# Altium project Ultrasound Smart Probe_Ver2.PrjPcb (part 2 of 9)

## Sheet FX3_Interface.SchDoc: FX3 Interface
size 431 x 279 mm; Date: Not shown in title block; ApprovedBy: Not shown in title block; CheckedBy: Not shown in title block; Author: Not shown in title block; CompanyName: Not shown in title block; DrawnBy: Abhishek Vishwa; Engineer: Not shown in title block; Organization: Not shown in title block; Address1: Not shown in title block; Address2: Not shown in title block; Address3: Not shown in title block; Address4: Not shown in title block; DocumentNumber: 1; Revision: Use project parameter SCH_Rev; SheetNumber: 3; SheetTotal: 12; PageSetup: Record=PageOptions|CenterHorizontal=True|CenterVertical=True|PrintScale=1.00|XCorrection=1.00|YCorrection=1.00|PrintKind=0|BorderSize=5000000|LeftOffset=0|BottomOffset=0|Orientation=2|PaperLength=1000|PaperWidth=1000|Scale=100|PaperSource=15|PrintQuality=600|MediaType=1|DitherType=10|PaperKind=Letter|PrintScaleMode=1; CurrentTime: Not shown in title block; CurrentDate: Not shown in title block; Time: Not shown in title block; DocumentFullPathAndName: Not shown in title block; DocumentName: Not shown in title block; ModifiedDate: Not shown in title block; ImagePath: Not shown in title block
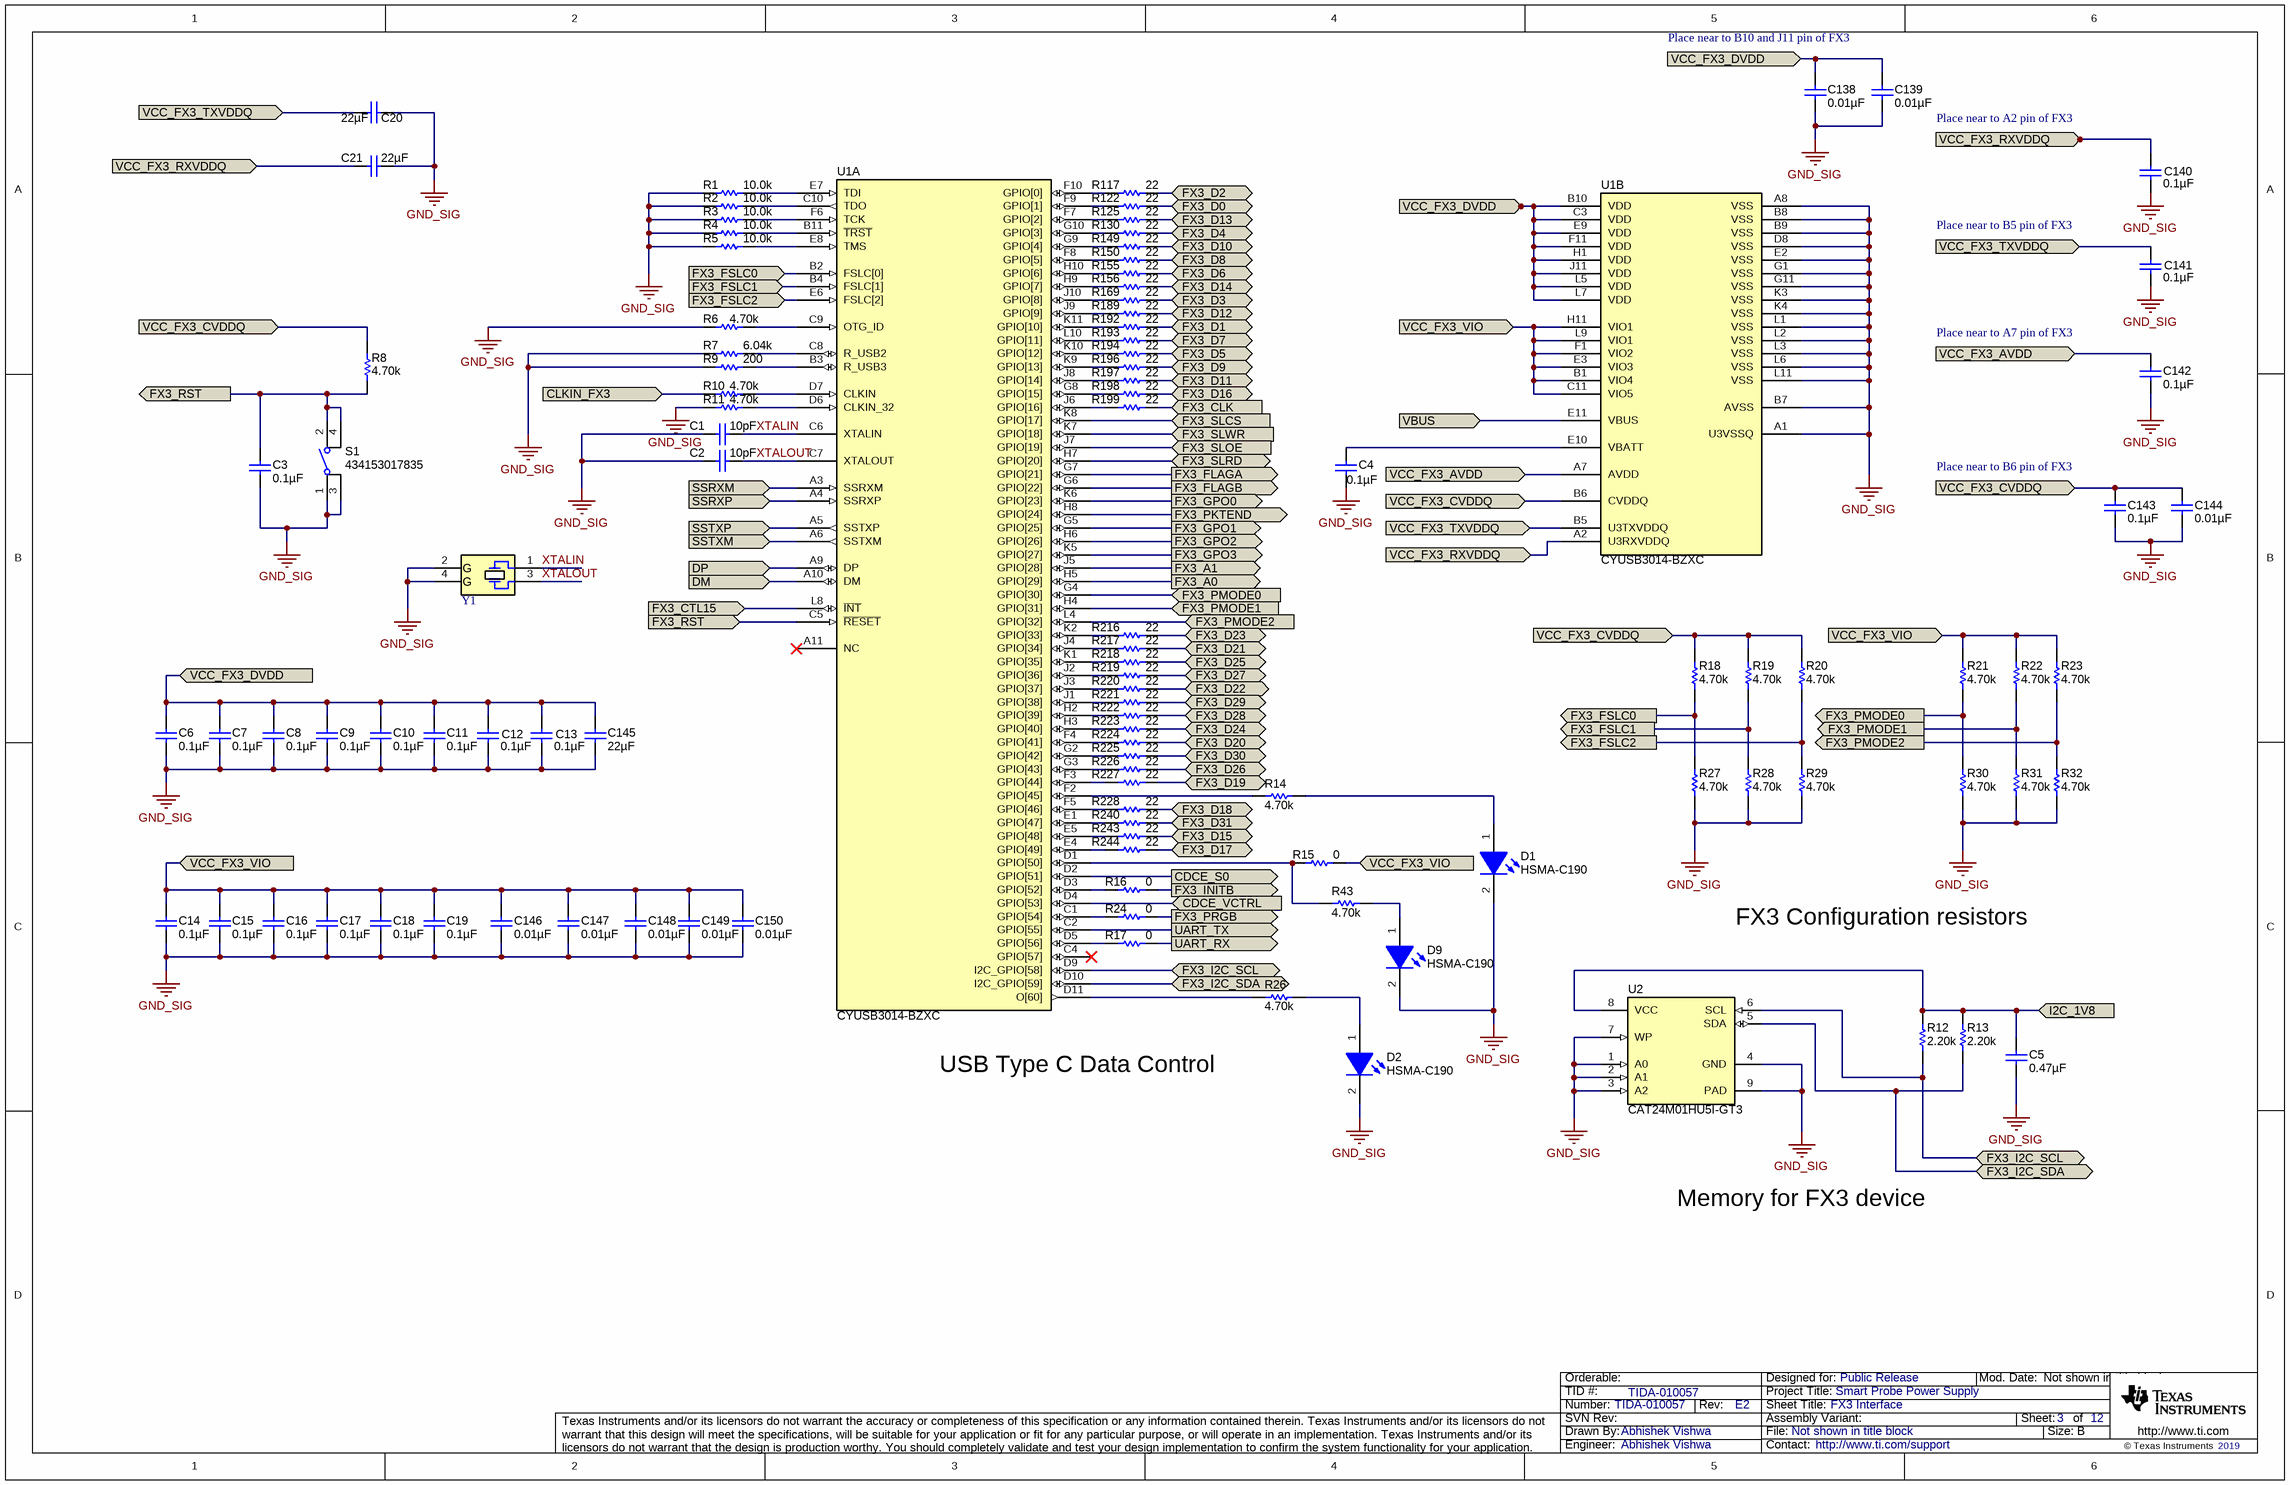
[diagram p1: FX3_Interface.SchDoc]

### Parts
C1  ValueDisplayed: 10pF  [0402]  (hidden comment: GRM1555C1H100FA01D)
C2  ValueDisplayed: 10pF  [0402]  (hidden comment: GRM1555C1H100FA01D)
C3  ValueDisplayed: 0.1µF  [0402]  (hidden comment: GRM155R61E104KA87D)
C4  ValueDisplayed: 0.1µF  [0402]  (hidden comment: GRM155R61E104KA87D)
C5  ValueDisplayed: 0.47µF  [0603]  (hidden comment: GRM188R61C474KA93D)
C6  ValueDisplayed: 0.1µF  [0201_033]  (hidden comment: C0603X6S1C104K030BC)
C7  ValueDisplayed: 0.1µF  [0201_033]  (hidden comment: C0603X6S1C104K030BC)
C8  ValueDisplayed: 0.1µF  [0201_033]  (hidden comment: C0603X6S1C104K030BC)
C9  ValueDisplayed: 0.1µF  [0201_033]  (hidden comment: C0603X6S1C104K030BC)
C10  ValueDisplayed: 0.1µF  [0201_033]  (hidden comment: C0603X6S1C104K030BC)
C11  ValueDisplayed: 0.1µF  [0201_033]  (hidden comment: C0603X6S1C104K030BC)
C12  ValueDisplayed: 0.1µF  [0201_033]  (hidden comment: C0603X6S1C104K030BC)
C13  ValueDisplayed: 0.1µF  [0201_033]  (hidden comment: C0603X6S1C104K030BC)
C14  ValueDisplayed: 0.1µF  [0201_033]  (hidden comment: C0603X6S1C104K030BC)
C15  ValueDisplayed: 0.1µF  [0201_033]  (hidden comment: C0603X6S1C104K030BC)
C16  ValueDisplayed: 0.1µF  [0201_033]  (hidden comment: C0603X6S1C104K030BC)
C17  ValueDisplayed: 0.1µF  [0201_033]  (hidden comment: C0603X6S1C104K030BC)
C18  ValueDisplayed: 0.1µF  [0201_033]  (hidden comment: C0603X6S1C104K030BC)
C19  ValueDisplayed: 0.1µF  [0201_033]  (hidden comment: C0603X6S1C104K030BC)
C20  ValueDisplayed: 22µF  [0603]  (hidden comment: C1608X5R0J226M080AC)
C21  ValueDisplayed: 22µF  [0603]  (hidden comment: C1608X5R0J226M080AC)
C138  ValueDisplayed: 0.01µF  [0201]  (hidden comment: GRM033R60J103KA01D)
C139  ValueDisplayed: 0.01µF  [0201]  (hidden comment: GRM033R60J103KA01D)
C140  ValueDisplayed: 0.1µF  [0201_033]  (hidden comment: C0603X6S1C104K030BC)
C141  ValueDisplayed: 0.1µF  [0201_033]  (hidden comment: C0603X6S1C104K030BC)
C142  ValueDisplayed: 0.1µF  [0201_033]  (hidden comment: C0603X6S1C104K030BC)
C143  ValueDisplayed: 0.1µF  [0201_033]  (hidden comment: C0603X6S1C104K030BC)
C144  ValueDisplayed: 0.01µF  [0201]  (hidden comment: GRM033R60J103KA01D)
C145  ValueDisplayed: 22µF  [0603]  (hidden comment: C1608X5R0J226M080AC)
C146  ValueDisplayed: 0.01µF  [0201]  (hidden comment: GRM033R60J103KA01D)
C147  ValueDisplayed: 0.01µF  [0201]  (hidden comment: GRM033R60J103KA01D)
C148  ValueDisplayed: 0.01µF  [0201]  (hidden comment: GRM033R60J103KA01D)
C149  ValueDisplayed: 0.01µF  [0201]  (hidden comment: GRM033R60J103KA01D)
C150  ValueDisplayed: 0.01µF  [0201]  (hidden comment: GRM033R60J103KA01D)
D1  HSMA-C190  [HSMx-C190_Amber]
D2  HSMA-C190  [HSMx-C190_Amber]
D9  HSMA-C190  [HSMx-C190_Amber]
R1  ValueDisplayed: 10.0k  [0402]  (hidden comment: ERJ-2RKF1002X)
R2  ValueDisplayed: 10.0k  [0402]  (hidden comment: ERJ-2RKF1002X)
R3  ValueDisplayed: 10.0k  [0402]  (hidden comment: ERJ-2RKF1002X)
R4  ValueDisplayed: 10.0k  [0402]  (hidden comment: ERJ-2RKF1002X)
R5  ValueDisplayed: 10.0k  [0402]  (hidden comment: ERJ-2RKF1002X)
R6  ValueDisplayed: 4.70k  [0402]  (hidden comment: ERJ-2RKF4701X)
R7  ValueDisplayed: 6.04k  [0402]  (hidden comment: CRCW04026K04FKED)
R8  ValueDisplayed: 4.70k  [0402]  (hidden comment: ERJ-2RKF4701X)
R9  ValueDisplayed: 200  [0603]  (hidden comment: CRCW0603200RFKEA)
R10  ValueDisplayed: 4.70k  [0402]  (hidden comment: ERJ-2RKF4701X)
R11  ValueDisplayed: 4.70k  [0402]  (hidden comment: ERJ-2RKF4701X)
R12  ValueDisplayed: 2.20k  [0402]  (hidden comment: ERJ-2RKF2201X)
R13  ValueDisplayed: 2.20k  [0402]  (hidden comment: ERJ-2RKF2201X)
R14  ValueDisplayed: 4.70k  [0402]  (hidden comment: ERJ-2RKF4701X)
R15  ValueDisplayed: 0  [0402]  (hidden comment: ERJ-2GE0R00X)
R16  ValueDisplayed: 0  [0402]  (hidden comment: ERJ-2GE0R00X)
R17  ValueDisplayed: 0  [0402]  (hidden comment: ERJ-2GE0R00X)
R18  ValueDisplayed: 4.70k  [0201]  (hidden comment: RC0201DR-074K7L)
R19  ValueDisplayed: 4.70k  [0201]  (hidden comment: RC0201DR-074K7L)
R20  ValueDisplayed: 4.70k  [0201]  (hidden comment: RC0201DR-074K7L)
R21  ValueDisplayed: 4.70k  [0201]  (hidden comment: RC0201DR-074K7L)
R22  ValueDisplayed: 4.70k  [0201]  (hidden comment: RC0201DR-074K7L)
R23  ValueDisplayed: 4.70k  [0201]  (hidden comment: RC0201DR-074K7L)
R24  ValueDisplayed: 0  [0402]  (hidden comment: ERJ-2GE0R00X)
R26  ValueDisplayed: 4.70k  [0402]  (hidden comment: ERJ-2RKF4701X)
R27  ValueDisplayed: 4.70k  [0201]  (hidden comment: RC0201DR-074K7L)
R28  ValueDisplayed: 4.70k  [0201]  (hidden comment: RC0201DR-074K7L)
R29  ValueDisplayed: 4.70k  [0201]  (hidden comment: RC0201DR-074K7L)
R30  ValueDisplayed: 4.70k  [0201]  (hidden comment: RC0201DR-074K7L)
R31  ValueDisplayed: 4.70k  [0201]  (hidden comment: RC0201DR-074K7L)
R32  ValueDisplayed: 4.70k  [0201]  (hidden comment: RC0201DR-074K7L)
R43  ValueDisplayed: 4.70k  [0402]  (hidden comment: ERJ-2RKF4701X)
R117  ValueDisplayed: 22  [0201]  (hidden comment: RC0201JR-0722RL)
R122  ValueDisplayed: 22  [0201]  (hidden comment: RC0201JR-0722RL)
R125  ValueDisplayed: 22  [0201]  (hidden comment: RC0201JR-0722RL)
R130  ValueDisplayed: 22  [0201]  (hidden comment: RC0201JR-0722RL)
R149  ValueDisplayed: 22  [0201]  (hidden comment: RC0201JR-0722RL)
R150  ValueDisplayed: 22  [0201]  (hidden comment: RC0201JR-0722RL)
R155  ValueDisplayed: 22  [0201]  (hidden comment: RC0201JR-0722RL)
R156  ValueDisplayed: 22  [0201]  (hidden comment: RC0201JR-0722RL)
R169  ValueDisplayed: 22  [0201]  (hidden comment: RC0201JR-0722RL)
R189  ValueDisplayed: 22  [0201]  (hidden comment: RC0201JR-0722RL)
R192  ValueDisplayed: 22  [0201]  (hidden comment: RC0201JR-0722RL)
R193  ValueDisplayed: 22  [0201]  (hidden comment: RC0201JR-0722RL)
R194  ValueDisplayed: 22  [0201]  (hidden comment: RC0201JR-0722RL)
R196  ValueDisplayed: 22  [0201]  (hidden comment: RC0201JR-0722RL)
R197  ValueDisplayed: 22  [0201]  (hidden comment: RC0201JR-0722RL)
R198  ValueDisplayed: 22  [0201]  (hidden comment: RC0201JR-0722RL)
R199  ValueDisplayed: 22  [0201]  (hidden comment: RC0201JR-0722RL)
R216  ValueDisplayed: 22  [0201]  (hidden comment: RC0201JR-0722RL)
R217  ValueDisplayed: 22  [0201]  (hidden comment: RC0201JR-0722RL)
R218  ValueDisplayed: 22  [0201]  (hidden comment: RC0201JR-0722RL)
R219  ValueDisplayed: 22  [0201]  (hidden comment: RC0201JR-0722RL)
R220  ValueDisplayed: 22  [0201]  (hidden comment: RC0201JR-0722RL)
R221  ValueDisplayed: 22  [0201]  (hidden comment: RC0201JR-0722RL)
R222  ValueDisplayed: 22  [0201]  (hidden comment: RC0201JR-0722RL)
R223  ValueDisplayed: 22  [0201]  (hidden comment: RC0201JR-0722RL)
R224  ValueDisplayed: 22  [0201]  (hidden comment: RC0201JR-0722RL)
R225  ValueDisplayed: 22  [0201]  (hidden comment: RC0201JR-0722RL)
R226  ValueDisplayed: 22  [0201]  (hidden comment: RC0201JR-0722RL)
R227  ValueDisplayed: 22  [0201]  (hidden comment: RC0201JR-0722RL)
R228  ValueDisplayed: 22  [0201]  (hidden comment: RC0201JR-0722RL)
R240  ValueDisplayed: 22  [0201]  (hidden comment: RC0201JR-0722RL)
R243  ValueDisplayed: 22  [0201]  (hidden comment: RC0201JR-0722RL)
R244  ValueDisplayed: 22  [0201]  (hidden comment: RC0201JR-0722RL)
S1  434153017835  [SW_434153017835]
U1  CYUSB3014-BZXC  [BZ-121]  (parts A,B of 2)
U2  CAT24M01HU5I-GT3  [8MA2]
Y1  ECS-192-18-33-JEM-TR  [ECS_ECX-32]  (value not drawn)

### Ports
CDCE_S0 (out), CDCE_VCTRL (in), CLKIN_FX3 (in), DM (in), DP (in), FX3_A0 (out), FX3_A1 (out), FX3_CLK (in), FX3_CTL15 (in), FX3_D0 (bidir), FX3_D1 (bidir), FX3_D2 (bidir), FX3_D3 (bidir), FX3_D4 (bidir), FX3_D5 (bidir), FX3_D6 (bidir), FX3_D7 (bidir), FX3_D8 (bidir), FX3_D9 (bidir), FX3_D10 (bidir), FX3_D11 (bidir), FX3_D12 (bidir), FX3_D13 (bidir), FX3_D14 (bidir), FX3_D15 (bidir), FX3_D16 (bidir), FX3_D17 (bidir), FX3_D18 (bidir), FX3_D19 (bidir), FX3_D20 (bidir), FX3_D21 (bidir), FX3_D22 (bidir), FX3_D23 (bidir), FX3_D24 (bidir), FX3_D25 (bidir), FX3_D26 (bidir), FX3_D27 (bidir), FX3_D28 (bidir), FX3_D29 (bidir), FX3_D30 (bidir), FX3_D31 (bidir), FX3_FLAGA (out), FX3_FLAGB (out), FX3_FSLC0 (in), FX3_FSLC0 (out), FX3_FSLC1 (in), FX3_FSLC1 (out), FX3_FSLC2 (in), FX3_FSLC2 (out), FX3_GPO0 (out), FX3_GPO1 (out), FX3_GPO2 (out), FX3_GPO3 (out), FX3_I2C_SCL (bidir), FX3_I2C_SDA (bidir), FX3_INITB (out), FX3_PKTEND (out), FX3_PMODE0 (in), FX3_PMODE0 (out), FX3_PMODE1 (in), FX3_PMODE1 (out), FX3_PMODE2 (in), FX3_PMODE2 (out), FX3_PRGB (out), FX3_RST (in), FX3_RST (out), FX3_SLCS (in), FX3_SLOE (in), FX3_SLRD (bidir), FX3_SLWR (in), I2C_1V8 (in), SSRXM (in), SSRXP (in), SSTXM (in), SSTXP (in), UART_RX (out), UART_TX (out), VBUS (in), VCC_FX3_AVDD (in), VCC_FX3_CVDDQ (in), VCC_FX3_DVDD (in), VCC_FX3_RXVDDQ (in), VCC_FX3_TXVDDQ (in), VCC_FX3_VIO (in)

### Nets
GND_SIG: C1.2 C2.2 C3.2 C4.2 C5.2 C6.2 C7.2 C8.2 C9.2 C10.2 C11.2 C12.2 C13.2 C14.2 C15.2 C16.2 C17.2 C18.2 C19.2 C20.1 C21.1 C138.2 C139.1 C140.2 C141.2 C142.2 C143.2 C144.2 C145.2 C146.2 C147.2 C148.2 C149.2 C150.2 D1.2(K) D2.2(K) D9.2(K) R1.1 R2.1 R3.1 R4.1 R5.1 R6.1 R7.2 R9.1 R11.1 R27.1 R28.1 R29.1 R30.1 R31.1 R32.1 S1.1 S1.3 U1.A1(U3VSSQ) U1.A8(VSS) U1.B7(AVSS) U1.B8(VSS) U1.B9(VSS) U1.D8(VSS) U1.E2(VSS) U1.G1(VSS) U1.G11(VSS) U1.K3(VSS) U1.K4(VSS) U1.L1(VSS) U1.L2(VSS) U1.L3(VSS) U1.L6(VSS) U1.L11(VSS) U2.1(A0) U2.2(A1) U2.3(A2) U2.4(GND) U2.7(WP) U2.9(PAD) Y1.2(GND) Y1.4(GND)
CDCE_S0: U1.D2(GPIO[51]) ; port CDCE_S0
CDCE_VCTRL: U1.D4(GPIO[53]) ; port CDCE_VCTRL
CLKIN_FX3: R10.1 ; port CLKIN_FX3
DM: U1.A10(DM) ; port DM
DP: U1.A9(DP) ; port DP
FX3_A0: U1.H5(GPIO[29]) ; port FX3_A0
FX3_A1: U1.J5(GPIO[28]) ; port FX3_A1
FX3_CLK: R199.2 ; port FX3_CLK
FX3_CTL15: U1.L8(~{INT}) ; port FX3_CTL15
FX3_D0: R122.2 ; port FX3_D0
FX3_D1: R192.2 ; port FX3_D1
FX3_D2: R117.2 ; port FX3_D2
FX3_D3: R169.2 ; port FX3_D3
FX3_D4: R130.2 ; port FX3_D4
FX3_D5: R194.2 ; port FX3_D5
FX3_D6: R155.2 ; port FX3_D6
FX3_D7: R193.2 ; port FX3_D7
FX3_D8: R150.2 ; port FX3_D8
FX3_D9: R196.2 ; port FX3_D9
FX3_D10: R149.2 ; port FX3_D10
FX3_D11: R197.2 ; port FX3_D11
FX3_D12: R189.2 ; port FX3_D12
FX3_D13: R125.2 ; port FX3_D13
FX3_D14: R156.2 ; port FX3_D14
FX3_D15: R243.2 ; port FX3_D15
FX3_D16: R198.2 ; port FX3_D16
FX3_D17: R244.2 ; port FX3_D17
FX3_D18: R228.2 ; port FX3_D18
FX3_D19: R227.2 ; port FX3_D19
FX3_D20: R224.2 ; port FX3_D20
FX3_D21: R217.2 ; port FX3_D21
FX3_D22: R220.2 ; port FX3_D22
FX3_D23: R216.2 ; port FX3_D23
FX3_D24: R223.2 ; port FX3_D24
FX3_D25: R218.2 ; port FX3_D25
FX3_D26: R226.2 ; port FX3_D26
FX3_D27: R219.2 ; port FX3_D27
FX3_D28: R222.2 ; port FX3_D28
FX3_D29: R221.2 ; port FX3_D29
FX3_D30: R225.2 ; port FX3_D30
FX3_D31: R240.2 ; port FX3_D31
FX3_FLAGA: U1.G7(GPIO[21]) ; port FX3_FLAGA
FX3_FLAGB: U1.G6(GPIO[22]) ; port FX3_FLAGB
FX3_FSLC0: R18.1 R27.2 U1.B2(FSLC[0]) ; port FX3_FSLC0
FX3_FSLC1: R19.1 R28.2 U1.B4(FSLC[1]) ; port FX3_FSLC1
FX3_FSLC2: R20.1 R29.2 U1.E6(FSLC[2]) ; port FX3_FSLC2
FX3_GPO0: U1.K6(GPIO[23]) ; port FX3_GPO0
FX3_GPO1: U1.G5(GPIO[25]) ; port FX3_GPO1
FX3_GPO2: U1.H6(GPIO[26]) ; port FX3_GPO2
FX3_GPO3: U1.K5(GPIO[27]) ; port FX3_GPO3
FX3_I2C_SCL: R12.1 U1.D9(I2C_GPIO[58]) U2.6(SCL) ; port FX3_I2C_SCL
FX3_I2C_SDA: R13.1 U1.D10(I2C_GPIO[59]) U2.5(SDA) ; port FX3_I2C_SDA
FX3_INITB: R16.2 ; port FX3_INITB
FX3_PKTEND: U1.H8(GPIO[24]) ; port FX3_PKTEND
FX3_PMODE0: R21.1 R30.2 U1.G4(GPIO[30]) ; port FX3_PMODE0
FX3_PMODE1: R22.1 R31.2 U1.H4(GPIO[31]) ; port FX3_PMODE1
FX3_PMODE2: R23.1 R32.2 U1.L4(GPIO[32]) ; port FX3_PMODE2
FX3_PRGB: R24.2 ; port FX3_PRGB
FX3_RST: C3.1 R8.1 S1.2 S1.4 U1.C5(~{RESET}) ; port FX3_RST
FX3_SLCS: U1.K8(GPIO[17]) ; port FX3_SLCS
FX3_SLOE: U1.J7(GPIO[19]) ; port FX3_SLOE
FX3_SLRD: U1.H7(GPIO[20]) ; port FX3_SLRD
FX3_SLWR: U1.K7(GPIO[18]) ; port FX3_SLWR
I2C_1V8: C5.1 R12.2 R13.2 U2.8(VCC) ; port I2C_1V8
SSRXM: U1.A3(SSRXM) ; port SSRXM
SSRXP: U1.A4(SSRXP) ; port SSRXP
SSTXM: U1.A6(SSTXM) ; port SSTXM
SSTXP: U1.A5(SSTXP) ; port SSTXP
UART_RX: R17.2 ; port UART_RX
UART_TX: U1.C2(GPIO[55]) ; port UART_TX
VBUS: U1.E11(VBUS) ; port VBUS
VCC_FX3_AVDD: C142.1 U1.A7(AVDD) ; port VCC_FX3_AVDD
VCC_FX3_CVDDQ: C143.1 C144.1 R8.2 R18.2 R19.2 R20.2 U1.B6(CVDDQ) ; port VCC_FX3_CVDDQ
VCC_FX3_DVDD: C6.1 C7.1 C8.1 C9.1 C10.1 C11.1 C12.1 C13.1 C138.1 C139.2 C145.1 U1.B10(VDD) U1.C3(VDD) U1.E9(VDD) U1.F11(VDD) U1.H1(VDD) U1.J11(VDD) U1.L5(VDD) U1.L7(VDD) ; port VCC_FX3_DVDD
VCC_FX3_RXVDDQ: C21.2 C140.1 U1.A2(U3RXVDDQ) ; port VCC_FX3_RXVDDQ
VCC_FX3_TXVDDQ: C20.2 C141.1 U1.B5(U3TXVDDQ) ; port VCC_FX3_TXVDDQ
VCC_FX3_VIO: C14.1 C15.1 C16.1 C17.1 C18.1 C19.1 C146.1 C147.1 C148.1 C149.1 C150.1 R15.2 R21.2 R22.2 R23.2 U1.B1(VIO4) U1.C11(VIO5) U1.E3(VIO3) U1.F1(VIO2) U1.H11(VIO1) U1.L9(VIO1) ; port VCC_FX3_VIO
XTALIN: C1.1 U1.C6(XTALIN) Y1.1
XTALOUT: C2.1 U1.C7(XTALOUT) Y1.3
NetC4_1: C4.1 U1.E10(VBATT)
NetD1_1: D1.1(A) R14.2
NetD2_1: D2.1(A) R26.2
NetD9_1: D9.1(A) R43.2
NetR1_2: R1.2 U1.E7(TDI)
NetR2_2: R2.2 U1.C10(TDO)
NetR3_2: R3.2 U1.F6(TCK)
NetR4_2: R4.2 U1.B11(~{TRST})
NetR5_2: R5.2 U1.E8(TMS)
NetR6_2: R6.2 U1.C9(OTG_ID)
NetR7_1: R7.1 U1.C8(R_USB2)
NetR9_2: R9.2 U1.B3(R_USB3)
NetR10_2: R10.2 U1.D7(CLKIN)
NetR11_2: R11.2 U1.D6(CLKIN_32)
NetR14_1: R14.1 U1.F2(GPIO[45])
NetR15_1: R15.1 R43.1 U1.D1(GPIO[50])
NetR16_1: R16.1 U1.D3(GPIO[52])
NetR17_1: R17.1 U1.D5(GPIO[56])
NetR24_1: R24.1 U1.C1(GPIO[54])
NetR26_1: R26.1 U1.D11(O[60])
NetR117_1: R117.1 U1.F10(GPIO[0])
NetR122_1: R122.1 U1.F9(GPIO[1])
NetR125_1: R125.1 U1.F7(GPIO[2])
NetR130_1: R130.1 U1.G10(GPIO[3])
NetR149_1: R149.1 U1.G9(GPIO[4])
NetR150_1: R150.1 U1.F8(GPIO[5])
NetR155_1: R155.1 U1.H10(GPIO[6])
NetR156_1: R156.1 U1.H9(GPIO[7])
NetR169_1: R169.1 U1.J10(GPIO[8])
NetR189_1: R189.1 U1.J9(GPIO[9])
NetR192_1: R192.1 U1.K11(GPIO[10])
NetR193_1: R193.1 U1.L10(GPIO[11])
NetR194_1: R194.1 U1.K10(GPIO[12])
NetR196_1: R196.1 U1.K9(GPIO[13])
NetR197_1: R197.1 U1.J8(GPIO[14])
NetR198_1: R198.1 U1.G8(GPIO[15])
NetR199_1: R199.1 U1.J6(GPIO[16])
NetR216_1: R216.1 U1.K2(GPIO[33])
NetR217_1: R217.1 U1.J4(GPIO[34])
NetR218_1: R218.1 U1.K1(GPIO[35])
NetR219_1: R219.1 U1.J2(GPIO[36])
NetR220_1: R220.1 U1.J3(GPIO[37])
NetR221_1: R221.1 U1.J1(GPIO[38])
NetR222_1: R222.1 U1.H2(GPIO[39])
NetR223_1: R223.1 U1.H3(GPIO[40])
NetR224_1: R224.1 U1.F4(GPIO[41])
NetR225_1: R225.1 U1.G2(GPIO[42])
NetR226_1: R226.1 U1.G3(GPIO[43])
NetR227_1: R227.1 U1.F3(GPIO[44])
NetR228_1: R228.1 U1.F5(GPIO[46])
NetR240_1: R240.1 U1.E1(GPIO[47])
NetR243_1: R243.1 U1.E5(GPIO[48])
NetR244_1: R244.1 U1.E4(GPIO[49])

Not connected (* = marked no-connect by the designer): U1 A11(NC)* C4(GPIO[57])*

### Notes on the sheet
- Place near to B10 and J11 pin of FX3
- Place near to A2 pin of FX3
- Place near to B5 pin of FX3
- Place near to A7 pin of FX3
- (near C143) Place near to B6 pin of FX3
- FX3 Configuration resistors
- USB Type C Data Control
- Memory for FX3 device
- Drawn By:
- SVN Rev:
- Number:
- TID #:
- Orderable:
- Rev:
- Sheet Title:
- File:
- Project Title:
- Designed for:
- Assembly Variant:
- Mod. Date:
- Sheet:
- Size:
- of
- B
- http://www.ti.com
- Texas Instruments and/or its licensors do not warrant the accuracy or completeness of this specification or any information contained therein. Texas Instruments and/or its licensors do not warrant that this design will meet the specifications, will be suitable for your application or fit for any particular purpose, or will operate in an implementation. Texas Instruments and/or its licensors do not warrant that the design is production worthy. You should completely validate and test your design implementation to confirm the system functionality for your application.
- Engineer:
- Contact:
- © Texas Instruments
- (in symbol CMP-0086322-1) G

### Library data of the parts
C1 C2 = GRM1555C1H100FA01D: CAP, CERM, 10 pF, 50 V,+/- 1%, C0G/NP0, 0402; Manufacturer: MuRata; Polarized: N; CompType: Capacitor; Value: 10pF; U/M: EA; Cap_F: 0.00000000001; Tolerance_%: 1; VDC_V: 50; Value2: 50V; TaMin_C: -55; TaMax_C: 125; SizeArea_mm2: 0.5; SizeAreaWB_mm2: 3; SizeZ_mm: 0.6; AEC Category: Q200; SymbolVersion: 2008-07-09; PartNumber: GRM1555C1H100FA01D; PackageReference: 0402; RoHS: Y; MountType: SMT; Technology: Ceramic; TempCo: C0G/NP0; Cap_Case: 0402; SizeX_mm: 1; SizeY_mm: 0.5; Published: 2008-06-19; Publisher: Texas Instruments; LatestRevisionDate: 2017-06-22; ComponentLink1Description: Datasheet link; ComponentLink1URL: http://psearch.en.murata.com/capacitor/product/GRM1555C1H100FA01%23.pdf; Supplier 1: Digi-Key; Supplier Part Number 1: 490-6186-1-ND; Supplier 2: Mouser; Supplier Part Number 2: 81-GRM1555C1H100FA1D; AEC Qualified: N; AEC Grade: N/A
C3 C4 = GRM155R61E104KA87D: as C124 on sheet USB TYPE C Interface; SymbolVersion: 2008-07-09; PartNumber: GRM155R61E104KA87D; PackageReference: 0402; RoHS: Y; MountType: SMT; Technology: Ceramic; TempCo: X5R; Cap_Case: 0402; SizeY_mm: 0.5; Published: 2008-06-19; Publisher: Texas Instruments; LatestRevisionDate: 2017-06-22; ComponentLink1Description: Datasheet link; ComponentLink1URL: http://psearch.murata.com/capacitor/product/GRM155R61E104KA87%23.pdf; Supplier 1: Digi-Key; Supplier Part Number 1: 490-5920-1-ND; Supplier 2: Mouser; Supplier Part Number 2: 81-GRM155R61E104KA7D; AEC Qualified: N; AEC Grade: N/A; Green_EU RoHS: Passed; Green_EU RoHS-2: Passed
C5 = GRM188R61C474KA93D: CAP, CERM, 0.47 µF, 16 V,+/- 10%, X5R, 0603; Manufacturer: MuRata; Polarized: N; CompType: Capacitor; Value: 0.47uF; U/M: EA; Cap_F: 0.00000047; Tolerance_%: 10; VDC_V: 16; Value2: 16V; TaMin_C: -55; TaMax_C: 85; SizeArea_mm2: 1.28; SizeAreaWB_mm2: 4.68; SizeX_mm: 1.6; SizeY_mm: 0.8; SizeZ_mm: 1; AEC Category: Q200; Green_Lifecycle: Active; Green_REACh: Passed; SymbolVersion: 2008-07-09; PartNumber: GRM188R61C474KA93D; PackageReference: 0603; RoHS: Y; MountType: SMT; Technology: Ceramic; TempCo: X5R; Cap_Case: 0603; Published: 2008-06-19; Publisher: Texas Instruments; LatestRevisionDate: 2017-06-22; ComponentLink1Description: Datasheet link; ComponentLink1URL: http://search.murata.co.jp/Ceramy/PnsearchViewAction.do?HnOFG=ON&HnNFG=ON&SEL_CNT=50&sLang=en&sKey=GRM188R61C474KA93D&x=9&y=9&search=startwith; Supplier 1: Digi-Key; Supplier Part Number 1: GRM188R61C474KA93D-ND; Supplier 2: Mouser; Supplier Part Number 2: 81-GRM188R61C474KA3D; Supplier 3: Farnell; Supplier Part Number 3: 1828894; AEC Qualified: ?; Green_EU RoHS: Passed; Green_EU RoHS-2: Incomplete
C6-C19 C140-C143 = C0603X6S1C104K030BC: as C125 on sheet USB TYPE C Interface; SymbolVersion: 2008-07-09; PartNumber: C0603X6S1C104K030BC; PackageReference: 0201; RoHS: Y; MountType: SMT; Technology: Ceramic; TempCo: X6S; Published: 2008-06-19; Publisher: Texas Instruments; LatestRevisionDate: 2017-06-22; ComponentLink1Description: Datasheet link; ComponentLink1URL: http://product.tdk.com/en/catalog/datasheets/mlcc_commercial_general_en.pdf; Supplier 1: Digi-Key; Supplier Part Number 1: 445-15903-1-ND; Supplier 2: Newark; Supplier Part Number 2: 17X8592; Supplier 3: Mouser; Supplier Part Number 3: 810-C0603X6S1C104KBC; AEC Qualified: N; AEC Grade: N/A
C20 C21 C145 = C1608X5R0J226M080AC: CAP, CERM, 22 µF, 6.3 V,+/- 20%, X5R, 0603; Manufacturer: TDK; Polarized: N; CompType: Capacitor; Value: 22uF; U/M: EA; Cap_F: 0.000022; Tolerance_%: 20; VDC_V: 6.3; Value2: 6.3V; TaMin_C: -55; TaMax_C: 85; SizeArea_mm2: 1.28; SizeAreaWB_mm2: 4.68; SizeX_mm: 1.6; SizeY_mm: 0.8; SizeZ_mm: 1; AEC Category: Q200; Green_Lifecycle: Active; Green_REACh: Passed; SymbolVersion: 2008-07-09; PartNumber: C1608X5R0J226M080AC; PackageReference: 0603; RoHS: Y; MountType: SMT; Technology: Ceramic; TempCo: X5R; Cap_Case: 0603; Published: 2008-06-19; Publisher: Texas Instruments; LatestRevisionDate: 2017-06-22; ComponentLink1Description: Datasheet link; ComponentLink1URL: http://product.tdk.com/en/catalog/datasheets/mlcc_commercial_general_en.pdf; Supplier 1: Digi-Key; Supplier Part Number 1: 445-8028-1-ND; Supplier 2: Newark; Supplier Part Number 2: 04X3240; Supplier 3: Mouser; Supplier Part Number 3: 810-C1608X5R0J226M; AEC Qualified: ?; Green_EU RoHS: Passed; Green_EU RoHS-2: Passed
C138 C139 C144 C146-C150 = GRM033R60J103KA01D: CAP, CERM, 0.01 µF, 6.3 V,+/- 10%, X5R, 0201; Manufacturer: MuRata; Polarized: N; CompType: Capacitor; Value: 0.01uF; U/M: EA; Cap_F: 0.00000001; Tolerance_%: 10; VDC_V: 6.3; Value2: 6.3V; TaMin_C: -55; TaMax_C: 85; SizeArea_mm2: 0.18; SizeAreaWB_mm2: 2.08; SizeX_mm: 0.6; SizeY_mm: 0.3; SizeZ_mm: 0.26; AEC Category: Q200; Green_Lifecycle: Active; Green_REACh: Passed; SymbolVersion: 2008-07-09; PartNumber: GRM033R60J103KA01D; PackageReference: 0201; RoHS: Y; MountType: SMT; Technology: Ceramic; TempCo: X5R; Cap_Case: 0201; Published: 2008-06-19; Publisher: Texas Instruments; LatestRevisionDate: 2017-06-22; ComponentLink1Description: Datasheet link; ComponentLink1URL: http://search.murata.co.jp/Ceramy/PnsearchViewAction.do?HnOFG=ON&HnNFG=ON&SEL_CNT=50&sLang=en&sKey=GRM033R60J103KA01D&x=9&y=9&search=startwith; Supplier 1: Digi-Key; Supplier Part Number 1: 490-5403-1-ND; Supplier 2: Mouser; Supplier Part Number 2: 81-GRM033R60J103KA1D; AEC Qualified: ?; Green_EU RoHS: Passed; Green_EU RoHS-2: Incomplete
D1 D2 D9 = CMP-0003041-3: LED, Amber, SMD; Manufacturer: Avago; SizeY_mm: 0.8; Vf_V: 1.9V; Value1: 0.06W; Ir_A: 100µA; Power_TotalModule: 60mW; SizeZ_mm: 0.9; SizeX_mm: 1.6; Tjmax_C: 95°C; SizeArea_mm2: 1.28; Vr_V: 5V; SizeAreaWB_mm2: 4.68; Angle: 170; Io_A: 20mA; Type: AlInGaP; ComponentLink1URL: http://www.avagotech.com/docs/AV02-0112EN; MountType: SMT; Color: Amber; CompType: LED; RoHS: Y; PartNumber: HSMA-C190; ComponentLink1Description: Datasheet link; PackageReference: 1.6x0.8mm; Value: Amber; Value2: 1.9V
R1-R5 = ERJ-2RKF1002X: as R162 on sheet USB TYPE C Interface; SymbolVersion: 2009-05-29; PartNumber: ERJ-2RKF1002X; PackageReference: 0402; RoHS: Y; Value1: 1%; MountType: SMT; Technology: Thick Film; SizeX_mm: 1; SizeY_mm: 0.5; Published: 2008-06-26; Publisher: Texas Instruments; LatestRevisionDate: 2017-06-12; ComponentLink1Description: Datasheet link; ComponentLink1URL: http://industrial.panasonic.com/www-data/pdf/AOA0000/AOA0000CE2.pdf; Supplier 1: Digi-Key; Supplier Part Number 1: P10.0KLCT-ND; Supplier 2: Newark; Supplier Part Number 2: 90W2949; Supplier 3: Mouser; Supplier Part Number 3: 667-ERJ-2RKF1002X; AEC Qualified: ?; Green_EU RoHS: Passed with Exemption; Green_EU RoHS-2: Passed
R6 R8 R10 R11 R14 R26 R43 = ERJ-2RKF4701X: as R170 on sheet USB TYPE C Interface; SymbolVersion: 2009-05-29; PartNumber: ERJ-2RKF4701X; PackageReference: 0402; RoHS: Y; Value1: 1%; MountType: SMT; Technology: Thick Film; SizeX_mm: 1; SizeY_mm: 0.5; Published: 2008-06-26; Publisher: Texas Instruments; LatestRevisionDate: 2017-06-12; ComponentLink1Description: Datasheet link; ComponentLink1URL: http://industrial.panasonic.com/www-data/pdf/AOA0000/AOA0000CE2.pdf; Supplier 1: Digi-Key; Supplier Part Number 1: P4.70KLCT-ND; Supplier 2: Newark; Supplier Part Number 2: 64R5288; Supplier 3: Mouser; Supplier Part Number 3: 667-ERJ-2RKF4701X; AEC Qualified: ?; Green_EU RoHS: Passed with Exemption; Green_EU RoHS-2: Passed
R7 = CRCW04026K04FKED: RES, 6.04 k, 1%, 0.063 W, 0402; Manufacturer: Vishay-Dale; CompType: Resistor; Value: 6.04k; Res_ohm: 6040; Value_Code: 6k04; Tolerance_%: 1; Power_W: 0.063; Value2: 0.063W; VDC_V: 50; TempCo: 100 ppm/C; SizeArea_mm2: 0.5; SizeZ_mm: 0.6; EIA_Code: E96; U/M: EA; AEC Category: Q200; Green_Lifecycle: Active; Green_REACh: Passed; SymbolVersion: 2009-05-29; PartNumber: CRCW04026K04FKED; PackageReference: 0402; RoHS: Y; Value1: 1%; MountType: SMT; Technology: Thick Film; SizeX_mm: 1; SizeY_mm: 0.5; Published: 2008-06-26; Publisher: Texas Instruments; LatestRevisionDate: 2017-06-12; ComponentLink1Description: Datasheet link; ComponentLink1URL: http://www.vishay.com/docs/20035/dcrcwe3.pdf; Supplier 1: Digi-Key; Supplier Part Number 1: 541-6.04KLCT-ND; Supplier 2: Newark; Supplier Part Number 2: 52K7180; Supplier 3: Mouser; Supplier Part Number 3: 71-CRCW0402-6.04K-E3; AEC Qualified: ?; Green_EU RoHS: Passed with Exemption; Green_EU RoHS-2: Passed
R9 = CRCW0603200RFKEA: RES, 200, 1%, 0.1 W, 0603; Manufacturer: Vishay-Dale; CompType: Resistor; Value: 200; Value_Code: 200R; Tolerance_%: 1; Power_W: 0.1; Value2: 0.1W; VDC_V: 75; TempCo: 100 ppm/C; SizeArea_mm2: 1.28; SizeX_mm: 1.6; SizeY_mm: 0.8; EIA_Code: E96; U/M: EA; AEC Category: Q200; Green_Lifecycle: Active; Green_REACh: Passed; SymbolVersion: 2009-05-29; PartNumber: CRCW0603200RFKEA; PackageReference: 0603; RoHS: Y; Res_ohm: 200; Value1: 1%; MountType: SMT; Technology: Thick Film; SizeZ_mm: 1; Published: 2008-06-26; Publisher: Texas Instruments; LatestRevisionDate: 2017-06-13; ComponentLink1Description: Datasheet link; ComponentLink1URL: http://www.vishay.com/docs/20035/dcrcwe3.pdf; Supplier 1: Digi-Key; Supplier Part Number 1: 541-200HCT-ND; Supplier 2: Newark; Supplier Part Number 2: 52K8273; Supplier 3: Mouser; Supplier Part Number 3: 71-CRCW0603-200-E3; AEC Qualified: ?; Green_EU RoHS: Passed with Exemption; Green_EU RoHS-2: Passed
R12 R13 = ERJ-2RKF2201X: RES, 2.20 k, 1%, 0.1 W, 0402; Manufacturer: Panasonic; CompType: Resistor; Value: 2.20k; Res_ohm: 2200; Value_Code: 2k20; Tolerance_%: 1; Power_W: 0.1; Value2: 0.1W; VDC_V: 50; TempCo: 100 ppm/C; SizeArea_mm2: 0.5; SizeZ_mm: 0.6; U/M: EA; AEC Category: Q200; Green_Lifecycle: Active; Green_REACh: Passed; SymbolVersion: 2009-05-29; PartNumber: ERJ-2RKF2201X; PackageReference: 0402; RoHS: Y; Value1: 1%; MountType: SMT; Technology: Thick Film; SizeX_mm: 1; SizeY_mm: 0.5; Published: 2008-06-26; Publisher: Texas Instruments; LatestRevisionDate: 2017-06-12; ComponentLink1Description: Datasheet link; ComponentLink1URL: http://industrial.panasonic.com/www-data/pdf/AOA0000/AOA0000CE2.pdf; Supplier 1: Digi-Key; Supplier Part Number 1: P2.20KLCT-ND; Supplier 2: Newark; Supplier Part Number 2: 64R5268; Supplier 3: Mouser; Supplier Part Number 3: 667-ERJ-2RKF2201X; AEC Qualified: ?; Green_EU RoHS: Passed with Exemption; Green_EU RoHS-2: Passed
R15-R17 R24 = ERJ-2GE0R00X: as R146 on sheet USB TYPE C Interface; SymbolVersion: 2009-05-29; PartNumber: ERJ-2GE0R00X; PackageReference: 0402; RoHS: Y; Res_ohm: 0; Value1: 5%; MountType: SMT; Technology: Thick Film; SizeY_mm: 0.5; Published: 2008-06-26; Publisher: Texas Instruments; LatestRevisionDate: 2017-06-12; ComponentLink1Description: Datasheet link; ComponentLink1URL: http://www.panasonic.com/industrial/components/pdf/AOA0000CE1.pdf; Supplier 1: Digi-Key; Supplier Part Number 1: P0.0JCT-ND; Supplier 2: Newark; Supplier Part Number 2: 65T8307; Supplier 3: Mouser; Supplier Part Number 3: 667-ERJ-2GE0R00X; AEC Qualified: ?; Green_EU RoHS: Passed with Exemption; Green_EU RoHS-2: Passed
R18-R23 R27-R32 = RC0201DR-074K7L: RES, 4.70 k, 0.5%, 0.05 W, 0201; Manufacturer: Yageo America; CompType: Resistor; Value: 4.70k; Res_ohm: 4700; Value_Code: 4k70; Tolerance_%: 0.5; Power_W: 0.05; Value2: 0.05W; VDC_V: 25; TempCo: 200 ppm/C; SizeArea_mm2: 0.18; SizeX_mm: 0.6; SizeY_mm: 0.3; SizeZ_mm: 0.26; EIA_Code: E192; U/M: EA; AEC Category: Q200; AEC Qualified: N; SymbolVersion: 2009-05-29; PartNumber: RC0201DR-074K7L; PackageReference: 0201; RoHS: Y; Value1: 0.5%; MountType: SMT; Technology: Thick Film; Published: 2016-10-14; Publisher: Texas Instruments; LatestRevisionDate: 2017-04-07; ComponentLink1Description: Datasheet link; ComponentLink1URL: http://www.yageo.com/documents/recent/PYu-RC_Group_51_RoHS_L_5.pdf; Supplier 1: Digi-Key; Supplier Part Number 1: RC0201DR-074K7L-ND; Supplier 2: Mouser; Supplier Part Number 2: 603-RC0201DR-074K7L; AEC Grade: N/A
R117 R122 R125 R130 R149 R150 R155 R156 R169 R189 R192-R194 R196-R199 R216-R228 R240 R243 R244 = RC0201JR-0722RL: RES, 22, 5%, 0.05 W, 0201; Manufacturer: Yageo America; CompType: Resistor; Value: 22; Value_Code: 22R0; Tolerance_%: 5; Power_W: 0.05; Value2: 0.05W; VDC_V: 25; TempCo: 200 ppm/C; SizeArea_mm2: 0.18; SizeX_mm: 0.6; SizeY_mm: 0.3; SizeZ_mm: 0.26; EIA_Code: E24; U/M: EA; AEC Category: Q200; AEC Qualified: N; SymbolVersion: 2009-05-29; PartNumber: RC0201JR-0722RL; PackageReference: 0201; RoHS: Y; Res_ohm: 22; Value1: 5%; MountType: SMT; Technology: Thick Film; Published: 2016-10-14; Publisher: Texas Instruments; LatestRevisionDate: 2017-04-07; ComponentLink1Description: Datasheet link; ComponentLink1URL: http://www.yageo.com/documents/recent/PYu-RC_Group_51_RoHS_L_5.pdf; Supplier 1: Digi-Key; Supplier Part Number 1: 311-22NCT-ND; Supplier 2: Mouser; Supplier Part Number 2: 603-RC0201JR-0722RL; AEC Grade: N/A
S1 = CMP-0002302-1: Switch, SPST, Off-Mom, 0.05 A, 12 VDC, SMD; Manufacturer: Wurth Elektronik; CurrentRating_mA: 50A; PositionCount: 1; SizeX_mm: 4.3; SizeY_mm: 2.9; SizeZ_mm: 1.9; SizeArea_mm2: 12.47; VDC_V: 12V; SizeAreaWB_mm2: 20.67; Supplier 2: Mouser; Supplier 1: Digi-Key; Supplier Part Number 1: 732-10143-1-ND; Supplier Part Number 2: 710-434153017835; PartNumber: 434153017835; ComponentLink1Description: Datasheet URL; LatestRevisionDate: 2017-03-09; ComponentLink1URL: http://katalog.we-online.de/em/datasheet/434153017835.pdf; CompType: Switch; Publisher: Texas Instruments; Circuit: SPST; RoHS: Y; Orientation: Top Actuated; SwitchFunction: Off-Mom; PackageReference: 3.5x2.9mm; MountType: SMT
U1 = CMP-0081079-1: SuperSpeed USB Controller, BGA-121; Manufacturer: Cypress Semiconductor; SizeZ_mm: 1.7; SizeX_mm: 10; SizeArea_mm2: 100; SizeAreaWB_mm2: 144; ComponentLink1URL: http://www.cypress.com/file/140296/download; SizeY_mm: 10; Supplier Part Number 2: 54W7901; Supplier 3: Mouser; Supplier 1: Digi-Key; PackageReference: 10x10mm; RoHS: Y; Supplier Part Number 1: 428-3182-ND; PartNumber: CYUSB3014-BZXC; MountType: SMT; ComponentLink1Description: Datasheet URL; Supplier 2: Newark; Supplier Part Number 3: 727-CYUSB3014-BZXC; PartId: 1
U2 = CMP-0085313-1: I2C-Compatible, (2-wire) Serial EEPROM, 1-Mbit (131072 x 8), 8MA2; Manufacturer: ON-SEMI; ComponentLink1Description: Datasheet URL; PartNumber: CAT24M01HU5I-GT3; ComponentLink1URL: http://ww1.microchip.com/downloads/en/devicedoc/atmel-8720-seeprom-at24c512c-datasheet.pdf; PackageReference: UDFN-8; RoHS: Y; MountType: SMT
Y1 = CMP-0086322-1: Crystal, 19.2 MHz, 20 ppm, 18 pF, SMD; Manufacturer: ECS Inc.; AEC Category: Q200; TaMin_C: -20°C; Load Capacitance: 18 pF; Frequency Stability: 50 ppm; TaMax_C: 70°C; AEC Qualified: N; Frequency Tolerance: 20 ppm; MountType: SMT; ComponentLink1URL: http://www.ecsxtal.com/store/pdf/ecx-32.pdf; PackageReference: 3.2x2.5mm; ComponentLink1Description: Datasheet Link; PartNumber: ECS-192-18-33-JEM-TR; RoHS: Y; Frequency_Fixed: 19.2MHz; AEC Grade: N/A; CompType: Crystal